# Altium schematic sheet CAN bus.SchDoc
size A2
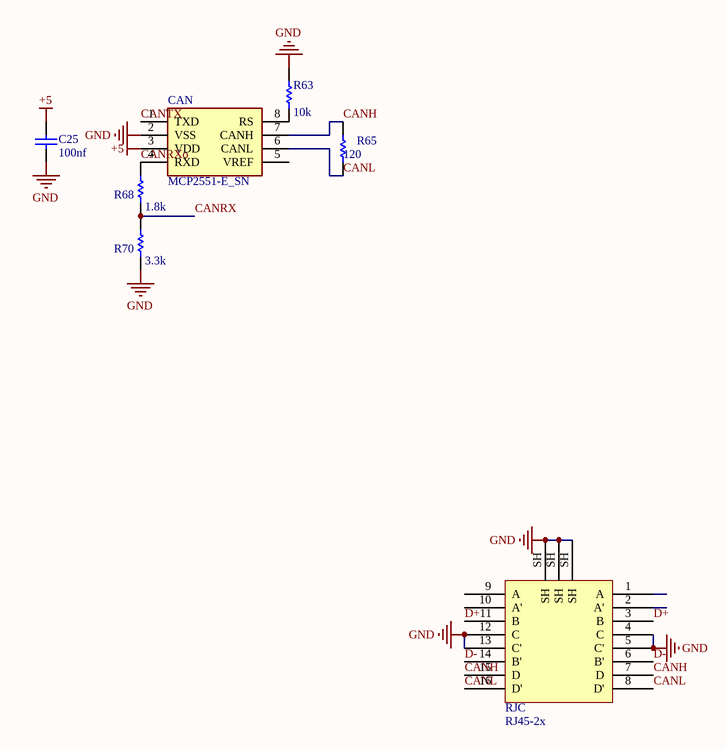
[diagram p0: CAN bus.SchDoc]

## Parts
C25  100nf  [0805]
CAN  MCP2551-E_SN  [SOIC127P600X175-8N]
R63  value 10k  [0805]
R65  value 120  [0805]
R68  value 1.8k  [0805]
R70  value 3.3k  [0805]
RJC  RJ45-2x  [RJ45_dual_right]

## Nets
+5: C25.2 CAN.3(VDD)
GND: C25.1 CAN.2(VSS) R63.1 R70.2 RJC.4(C) RJC.5(C') RJC.12(C) RJC.13(C') RJC.SH
CANH: CAN.7(CANH) R65.1 RJC.7(D) RJC.15(D)
CANL: CAN.6(CANL) R65.2 RJC.8(D') RJC.16(D')
CANRX: R68.2 R70.1
CANRXo: CAN.4(RXD) R68.1
CANTX: CAN.1(TXD)
D+: RJC.3(B) RJC.11(B)
D-: RJC.6(B') RJC.14(B')
NetCAN_8: CAN.8(RS) R63.2

Not connected (* = marked no-connect by the designer): CAN 5(VREF); RJC 1(A) 2(A') 9(A) 10(A')

## Library data of the parts
C25 = Cap: Capacitor; Published: 8-Jun-2000; LatestRevisionDate: 17-Jul-2002; LatestRevisionNote: Re-released for DXP Platform.; PackageReference: RAD-0.3; Publisher: Altium Limited; Value: 100nF
CAN = MCP2551-E_SN: Integrated Circuit; Manufacturer_Name: Microchip; Manufacturer_Part_Number: MCP2551-E/SN; Datasheet Link: https://datasheet.datasheetarchive.com/originals/distributors/SFDatasheet-4/sf-00090061.pdf; Height: 1.75mm; Mouser Part Number: 579-MCP2551-E/SN; Mouser Price/Stock: https://www.mouser.co.uk/ProductDetail/Microchip-Technology/MCP2551-E-SN?qs=Vn0zuzr35GHkGDCgnw0F9A%3D%3D; Arrow Part Number: MCP2551-E/SN; Arrow Price/Stock: https://www.arrow.com/en/products/mcp2551-esn/microchip-technology
R63 R65 R68 R70 = Res: Semiconductor Resistor; Published: 8-Jun-2000; LatestRevisionDate: 17-Jul-2002; LatestRevisionNote: Re-released for DXP Platform.; PackageReference: AXIAL-0.5; Publisher: Altium Limited
RJC = RJ45_dual_right: RJ45_Dual-Right